# Altium schematic sheet Power.SchDoc
size A4; SheetNumber: 2; SheetTotal: 5
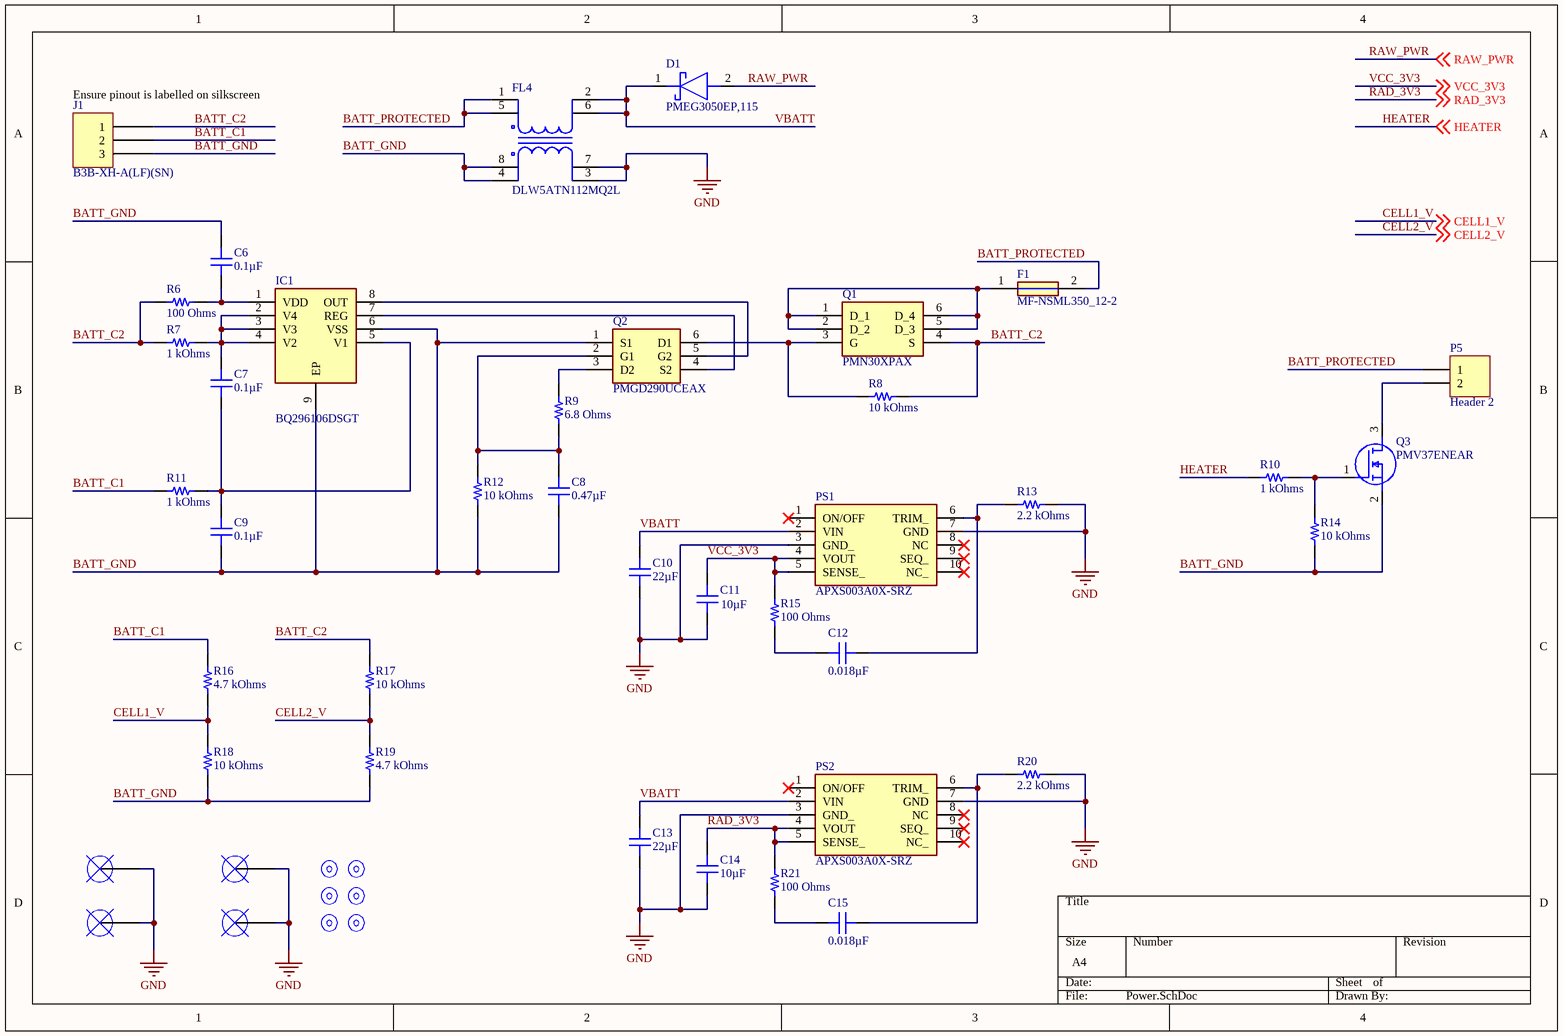
[diagram p0: Power.SchDoc]

## Parts
C6  0.1µF  [CAP 0402_1005]
C7  0.1µF  [CAP 0402_1005]
C8  0.47µF  [CAP 0402_1005]
C9  0.1µF  [CAP 0402_1005]
C10  22µF  [CAP 0805_2012]
C11  10µF  [CAP 0402_1005]
C12  0.018µF  [CAP 0402_1005]
C13  22µF  [CAP 0805_2012]
C14  10µF  [CAP 0402_1005]
C15  0.018µF  [CAP 0402_1005]
D1  PMEG3050EP,115  [PMEG3050EP115]
F1  MF-NSML350_12-2  [FUSC3216X140N]
FL4  DLW5ATN112MQ2L  [DLW5BSN302SQ2L]
FM1  1mm  [FIDUCIAL_MARK_ROUND]  (value not drawn)  (no BOM)
FM2  1mm  [FIDUCIAL_MARK_ROUND]  (value not drawn)  (no BOM)
FM3  1mm  [FIDUCIAL_MARK_ROUND]  (value not drawn)  (no BOM)
FM4  1mm  [FIDUCIAL_MARK_ROUND]  (value not drawn)  (no BOM)
FM5  1mm  [FIDUCIAL_MARK_ROUND]  (value not drawn)  (no BOM)
FM6  1mm  [FIDUCIAL_MARK_ROUND]  (value not drawn)  (no BOM)
IC1  BQ296106DSGT  [SON50P200X200X80-9N]
J1  B3B-XH-A(LF)(SN)  [JST XH B3B-XH-A]
MH1  2.7mm  [Mounting_Hole_Plated_2.7mm-COVERED]  (value not drawn)  (no BOM)
MH2  2.7mm  [Mounting_Hole_Plated_2.7mm-COVERED]  (value not drawn)  (no BOM)
MH3  2.7mm  [Mounting_Hole_Plated_2.7mm-COVERED]  (value not drawn)  (no BOM)
MH4  2.7mm  [Mounting_Hole_Plated_2.7mm-COVERED]  (value not drawn)  (no BOM)
P5  Header 2  [HDR1X2]
PS1  APXS003A0X-SRZ  [APTH003A0XSRZ]
PS2  APXS003A0X-SRZ  [APTH003A0XSRZ]
Q1  PMN30XPAX  [SOT95P275X110-6N]
Q2  PMGD290UCEAX  [SOT65P210X110-6N]
Q3  PMV37ENEAR  [SOT95P230X110-3N]
R6  100 Ohms  [RES 0402_1005]
R7  1 kOhms  [RES 0402_1005]
R8  10 kOhms  [RES 0402_1005]
R9  6.8 Ohms  [RES 0402_1005]
R10  1 kOhms  [RES 0402_1005]
R11  1 kOhms  [RES 0402_1005]
R12  10 kOhms  [RES 0402_1005]
R13  2.2 kOhms  [RES 0402_1005]
R14  10 kOhms  [RES 0402_1005]
R15  100 Ohms  [RES 0402_1005]
R16  4.7 kOhms  [RES 0402_1005]
R17  10 kOhms  [RES 0402_1005]
R18  10 kOhms  [RES 0402_1005]
R19  4.7 kOhms  [RES 0402_1005]
R20  2.2 kOhms  [RES 0402_1005]
R21  100 Ohms  [RES 0402_1005]

## Nets
GND: C10.1 C11.1 C13.1 C14.1 FL4.3 FL4.7 MH1.0 MH2.0 MH3.0 MH4.0 PS1.3(GND_) PS1.7(GND) PS2.3(GND_) PS2.7(GND) R13.1 R20.2
BATT_C1: J1.2 R11.1 R16.2
BATT_C2: J1.1 Q1.4(S) R6.2 R7.1 R8.1 R17.1
BATT_GND: C6.2 C8.1 C9.1 FL4.4 FL4.8 IC1.6(VSS) IC1.9(EP) J1.3 Q2.1(S1) Q3.2(S) R12.2 R14.2 R18.2 R19.1
BATT_PROTECTED: F1.2 FL4.1 FL4.5 P5.1
CELL1_V: R16.1 R18.1 ; off-sheet CELL1_V
CELL2_V: R17.2 R19.2 ; off-sheet CELL2_V
HEATER: R10.1 ; off-sheet HEATER
RAD_3V3: C14.2 PS2.4(VOUT) PS2.5(SENSE_) R21.1 ; off-sheet RAD_3V3
RAW_PWR: D1.2(A) ; off-sheet RAW_PWR
VBATT: C10.2 C13.2 D1.1(K) FL4.2 FL4.6 PS1.2(VIN) PS2.2(VIN)
VCC_3V3: C11.2 PS1.4(VOUT) PS1.5(SENSE_) R15.1 ; off-sheet VCC_3V3
NetC6_1: C6.1 IC1.1(VDD) R6.1
NetC7_1: C7.1 C9.2 IC1.5(V1) R11.2
NetC7_2: C7.2 IC1.2(V4) IC1.3(V3) IC1.4(V2) R7.2
NetC8_2: C8.2 Q2.2(G1) R9.1 R12.1
NetC12_1: C12.1 R15.2
NetC12_2: C12.2 PS1.6(TRIM_) R13.2
NetC15_1: C15.1 R21.2
NetC15_2: C15.2 PS2.6(TRIM_) R20.1
NetF1_1: F1.1 Q1.1(D_1) Q1.2(D_2) Q1.5(D_3) Q1.6(D_4)
NetIC1_7: IC1.7(REG) Q2.4(S2)
NetIC1_8: IC1.8(OUT) Q2.5(G2)
NetP5_2: P5.2 Q3.3(D)
NetQ1_3: Q1.3(G) Q2.6(D1) R8.2
NetQ2_3: Q2.3(D2) R9.2
NetQ3_1: Q3.1(G) R10.2 R14.1

Not connected (* = marked no-connect by the designer): FM1 FD0; FM2 FD0; FM3 FD0; FM4 FD0; FM5 FD0; FM6 FD0; PS1 1(ON/OFF)* 8(NC)* 9(SEQ_)* 10(NC_)*; PS2 1(ON/OFF)* 8(NC)* 9(SEQ_)* 10(NC_)*

## Notes on the sheet
- (near J1) Ensure pinout is labelled on silkscreen

## Library data of the parts
C6 C7 C9 = C0402C104K9PACTU: CAP CER 0.1UF 6.3V X5R 0402; Manufacturer: KEMET; Tolerance: ±10%; Part Number: C0402C104K9PACTU; Value: 0.1µF; Applications: General Purpose; Capacitance: 0.1µF; ComponentLink1Description: Datasheet; ComponentLink1URL: https://api.kemet.com/component-edge/download/datasheet/C0402C104K9PACTU.pdf; ComponentLink2Description: DigiKey Link; ComponentLink2URL: http://digikey.com/product-detail/en/kemet/C0402C104K9PACTU/399-3026-1-ND/447602; Device Package: 0402 (1005 Metric); LastUpdated: 2/9/2020 1:01:34 AM; Lifecycle Status: Active; Minimum Order: 1; Mounting Type: Surface Mount, MLCC; Operating Temperature: -55°C ~ 85°C; Package / Case: 0402 (1005 Metric); Packaging: TapeAndReel; PartId: 12742; Part Status: Active; Price: 0.01; Series: SMD Comm X5R; Size / Dimension: 0.039" L x 0.020" W (1.00mm x 0.50mm); Supplier 1: DigiKey; Supplier Part Number 1: 399-3026-1-ND; Temperature Coefficient: X5R; Thickness (Max): 0.022" (0.55mm); Voltage - Rated: 6.3V
C8 = C1005X5R1E474K050BE: CAP CER 0.47UF 25V X5R 0402; Manufacturer: TDK Corporation; Tolerance: ±10%; Part Number: C1005X5R1E474K050BE; Value: 0.47µF; Applications: Boardflex Sensitive; Capacitance: 0.47µF; ComponentLink1Description: Datasheet; ComponentLink1URL: https://product.tdk.com/info/en/catalog/datasheets/mlcc_commercial_soft_en.pdf?ref_disty=digikey; ComponentLink2Description: DigiKey Link; ComponentLink2URL: http://digikey.com/product-detail/en/tdk-corporation/C1005X5R1E474K050BE/445-175217-1-ND/7907781; Device Package: 0402 (1005 Metric); Features: Soft Termination; LastUpdated: 2/9/2020 1:01:22 AM; Lifecycle Status: Active; Minimum Order: 1; Mounting Type: Surface Mount, MLCC; Operating Temperature: -55°C ~ 85°C; Package / Case: 0402 (1005 Metric); Packaging: TapeAndReel; PartId: 13175; Part Status: Active; Price: 0.02; Series: C; Size / Dimension: 0.039" L x 0.020" W (1.00mm x 0.50mm); Supplier 1: DigiKey; Supplier Part Number 1: 445-175217-1-ND; Temperature Coefficient: X5R; Thickness (Max): 0.024" (0.60mm); Voltage - Rated: 25V
C10 C13 = C2012X6S1C226M125AC: CAP CER 22UF 16V X6S 0805; Manufacturer: TDK Corporation; Tolerance: ±20%; Part Number: C2012X6S1C226M125AC; Value: 22µF; Applications: General Purpose; Capacitance: 22µF; ComponentLink1Description: Datasheet; ComponentLink1URL: https://product.tdk.com/info/en/catalog/datasheets/mlcc_commercial_general_en.pdf?ref_disty=digikey; ComponentLink2Description: DigiKey Link; ComponentLink2URL: http://digikey.com/product-detail/en/tdk-corporation/C2012X6S1C226M125AC/445-14486-1-ND/3956152; Device Package: 0805 (2012 Metric); Features: Low ESL; LastUpdated: 2/9/2020 1:04:25 AM; Lifecycle Status: Active; Minimum Order: 1; Mounting Type: Surface Mount, MLCC; Operating Temperature: -55°C ~ 105°C; Package / Case: 0805 (2012 Metric); Packaging: TapeAndReel; PartId: 11672; Part Status: Active; Price: 0.19; Series: C; Size / Dimension: 0.079" L x 0.049" W (2.00mm x 1.25mm); Supplier 1: DigiKey; Supplier Part Number 1: 445-14486-1-ND; Temperature Coefficient: X6S; Thickness (Max): 0.057" (1.45mm); Voltage - Rated: 16V
C11 C14 = C0402C106M9PAC7867: CAP CER 10UF 6.3V X5R 0402; Manufacturer: KEMET; Tolerance: ±20%; Part Number: C0402C106M9PAC7867; Value: 10µF; Applications: General Purpose; Capacitance: 10µF; ComponentLink1Description: Datasheet; ComponentLink1URL: https://api.kemet.com/component-edge/download/datasheet/C0402C106M9PAC7867.pdf; ComponentLink2Description: DigiKey Link; ComponentLink2URL: http://digikey.com/product-detail/en/kemet/C0402C106M9PAC7867/399-13069-1-ND/5767556; Device Package: 0402 (1005 Metric); LastUpdated: 2/9/2020 1:02:21 AM; Lifecycle Status: Active; Minimum Order: 1; Mounting Type: Surface Mount, MLCC; Operating Temperature: -55°C ~ 85°C; Package / Case: 0402 (1005 Metric); Packaging: TapeAndReel; PartId: 3087; Part Status: Active; Price: 0.13; Series: SMD Comm X5R; Size / Dimension: 0.039" L x 0.020" W (1.00mm x 0.50mm); Supplier 1: DigiKey; Supplier Part Number 1: 399-13069-1-ND; Temperature Coefficient: X5R; Thickness (Max): 0.028" (0.70mm); Voltage - Rated: 6.3V
C12 C15 = CC0402KRX7R8BB183: CAP CER 0.018UF 25V X7R 0402; Manufacturer: Yageo; Tolerance: ±10%; Part Number: CC0402KRX7R8BB183; Value: 0.018µF; Applications: General Purpose; Capacitance: 0.018µF; ComponentLink1Description: Datasheet; ComponentLink1URL: https://www.yageo.com/upload/media/product/productsearch/datasheet/mlcc/UPY-GPHC_X7R_6.3V-to-50V_18.pdf; ComponentLink2Description: DigiKey Link; ComponentLink2URL: http://digikey.com/product-detail/en/yageo/CC0402KRX7R8BB183/311-3345-1-ND/6818315; Device Package: 0402 (1005 Metric); LastUpdated: 2/9/2020 1:02:03 AM; Lifecycle Status: Active; Minimum Order: 1; Mounting Type: Surface Mount, MLCC; Operating Temperature: -55°C ~ 125°C; Package / Case: 0402 (1005 Metric); Packaging: TapeAndReel; PartId: 11317; Part Status: Active; Price: 0.01; Series: CC; Size / Dimension: 0.039" L x 0.020" W (1.00mm x 0.50mm); Supplier 1: DigiKey; Supplier Part Number 1: 311-3345-1-ND; Temperature Coefficient: X7R; Thickness (Max): 0.022" (0.55mm); Voltage - Rated: 25V
D1 = PMEG3050EP,115: Schottky Diode; Manufacturer_Name: Nexperia; Datasheet Link: https://datasheet.datasheetarchive.com/originals/distributors/Datasheets_SAMA/fa882cf4aa6eed6383790f96e9182165.pdf; Height: 1mm; Manufacturer_Part_Number: PMEG3050EP,115
F1 = MF-NSML350_12-2: Fuse; Manufacturer_Name: Bourns; Manufacturer_Part_Number: MF-NSML350/12-2; Datasheet Link: https://componentsearchengine.com/Datasheets/1/MF-NSML350_12-2.pdf; Height: 1.4mm
FL4 = DLW5ATN112MQ2L: Filter; Manufacturer_Name: Murata Electronics; Datasheet Link: https://componentsearchengine.com//DLW5ATN112MQ2L.pdf; Height: 2.35mm; Mouser2 Part Number: 81-DLW5ATN112MQ2L; Mouser2 Price/Stock: https://www.mouser.com/Search/Refine.aspx?Keyword=81-DLW5ATN112MQ2L; Manufacturer_Part_Number: DLW5ATN112MQ2L
FM1-FM6 = Fiducial_Mark: Fiducial mark, width 1mm, clearance 3mm; Width: 1 mm; Clearance: 3 mm
IC1 = BQ296106DSGT: Integrated Circuit; Manufacturer_Name: Texas Instruments; Datasheet Link: https://www.ti.com/lit/ds/symlink/bq2961.pdf?ts=1629467003310&ref_url=https%253A%252F%252Fwww.ti.com%252Fstore%252Fti%252Fen%252Fp%252Fproduct%252F%253Fp%253DBQ296106DSGT; Height: 0.8mm; Manufacturer_Part_Number: BQ296106DSGT
J1 = B3B-XH-A(LF)(SN): CONN HEADER VERT 3POS 2.5MM; Manufacturer: JST Sales America Inc.; Contact Length - Post: 0.134" (3.40mm); Current Rating (Amps): 3A; Material Flammability Rating: UL94 V-0; Number of Positions: 3; Number of Positions Loaded: All; Pitch - Mating: 0.098" (2.50mm); Shrouding: Shrouded - 4 Wall; Style: Board to Cable/Wire; Voltage Rating: 250V; Part Number: B3B-XH-A(LF)(SN); ComponentLink1Description: Datasheet; ComponentLink1URL: http://www.jst-mfg.com/product/pdf/eng/eXH.pdf; ComponentLink2Description: DigiKey Link; ComponentLink2URL: http://digikey.com/product-detail/en/jst-sales-america-inc/B3B-XH-A-LF-SN/455-2248-ND/1651046; Connector Type: Header; Contact Finish - Mating: Tin; Contact Finish - Post: Tin; Contact Material: Brass; Contact Shape: Square; Contact Type: Male Pin; Fastening Type: Detent Lock; Insulation Color: Natural; Insulation Height: 0.276" (7.00mm); Insulation Material: Polyamide (PA66), Nylon 6/6; LastUpdated: 12/1/2020 11:46:22 PM; Lifecycle Status: Active; Minimum Order: 1; Mounting Type: Through Hole; Number of Rows: 1; Operating Temperature: -25°C ~ 85°C; Packaging: Bulk; PartId: 68; Part Status: Active; Price: 0.19; Series: XH; Supplier 1: DigiKey; Supplier Part Number 1: 455-2248-ND; Termination: Press-Fit, Solder
MH1-MH4 = Mounting_Hole_2.7mm: Mounting hole, hole size 2.7mm; Hole radius: 2.7 mm; Diameter (plated): *; Keep out (radius): *; Plated: *
P5 = Header 2: Header, 2-Pin; LatestRevisionDate: 17-Jul-2002; LatestRevisionNote: Re-released for DXP Platform.; Publisher: Altium Limited
PS1 PS2 = APXS003A0X-SRZ: Power Supply; Manufacturer_Name: ABB; Datasheet Link: https://www.mouser.sg/datasheet/2/167/APTS003A0X-1920083.pdf; Height: 6.25mm; Manufacturer_Part_Number: APXS003A0X-SRZ
Q1 = PMN30XPAX: MOSFET (P-Channel); Manufacturer_Name: Nexperia; Datasheet Link: https://www.mouser.in/datasheet/2/916/PMN30XPA-1839888.pdf; Height: 1.1mm; Manufacturer_Part_Number: PMN30XPAX
Q2 = PMGD290UCEAX: Transistor; Manufacturer_Name: Nexperia; Datasheet Link: https://ms.componentsearchengine.com/Datasheets/2/PMGD290UCEAX.pdf; Height: 1.1mm; Manufacturer_Part_Number: PMGD290UCEAX
Q3 = PMV37ENEAR: MOSFET (N-Channel); Manufacturer_Name: Nexperia; Datasheet Link: https://componentsearchengine.com/Datasheets/2/PMV37ENEAR.pdf; Height: 1.1mm; Manufacturer_Part_Number: PMV37ENEAR
R6 R15 R21 = CRG0402F100R: RES SMD 100 OHM 1% 1/16W 0402; Manufacturer: TE Connectivity Passive Product; Power (Watts): 0.063W, 1/16W; Temperature Coefficient: ±100ppm/°C; Part Number: CRG0402F100R; Value: 100 Ohms; ComponentLink1Description: Datasheet; ComponentLink1URL: https://www.te.com/commerce/DocumentDelivery/DDEController?Action=srchrtrv&DocNm=1773204&DocType=DS&DocLang=English; ComponentLink2Description: DigiKey Link; ComponentLink2URL: http://digikey.com/product-detail/en/te-connectivity-passive-product/CRG0402F100R/A121527CT-ND/5246516; Composition: Thick Film; Device Package: 0402 (1005 Metric); Height - Seated (Max): 0.016" (0.40mm); LastUpdated: 2/9/2020 1:07:28 AM; Lifecycle Status: Active; Minimum Order: 1; Number of Terminations: 2; Operating Temperature: -55°C ~ 155°C; Package / Case: 0402 (1005 Metric); Packaging: CutTape; PartId: 20718; Part Status: Active; Price: 0.10; Resistance: 100 Ohms; Series: CRG, Neohm; Size / Dimension: 0.039" L x 0.020" W (1.00mm x 0.50mm); Supplier 1: DigiKey; Supplier Part Number 1: A121527CT-ND; Supplier Device Package: 0402; Tolerance: ±1%
R7 R10 R11 = CRCW04021K00FKEDC: RES SMD 1K OHM 1% 1/16W 0402; Manufacturer: Vishay Dale; Power (Watts): 0.063W, 1/16W; Temperature Coefficient: ±100ppm/°C; Part Number: CRCW04021K00FKEDC; Value: 1 kOhms; ComponentLink1Description: Datasheet; ComponentLink1URL: http://www.vishay.com/docs/28773/crcwce3.pdf; ComponentLink2Description: DigiKey Link; ComponentLink2URL: http://digikey.com/product-detail/en/vishay-dale/CRCW04021K00FKEDC/541-3961-1-ND/7928644; Composition: Thick Film; Device Package: 0402 (1005 Metric); Height - Seated (Max): 0.014" (0.35mm); LastUpdated: 2/9/2020 1:07:49 AM; Lifecycle Status: Active; Minimum Order: 1; Number of Terminations: 2; Operating Temperature: -55°C ~ 155°C; Package / Case: 0402 (1005 Metric); Packaging: CutTape; PartId: 12669; Part Status: Active; Price: 0.10; Resistance: 1 kOhms; Series: CRCW-C; Size / Dimension: 0.039" L x 0.020" W (1.00mm x 0.50mm); Supplier 1: DigiKey; Supplier Part Number 1: 541-3961-1-ND; Supplier Device Package: 0402; Tolerance: ±1%
R8 R12 R14 R17 R18 = CPF0402B10KE1: RES SMD 10K OHM 0.1% 1/16W 0402; Manufacturer: TE Connectivity Passive Product; Power (Watts): 0.063W, 1/16W; Temperature Coefficient: ±25ppm/°C; Part Number: CPF0402B10KE1; Value: 10 kOhms; ComponentLink1Description: Datasheet; ComponentLink1URL: https://www.te.com/commerce/DocumentDelivery/DDEController?Action=srchrtrv&DocNm=1773200&DocType=DS&DocLang=English; ComponentLink2Description: DigiKey Link; ComponentLink2URL: http://digikey.com/product-detail/en/te-connectivity-passive-product/CPF0402B10KE1/A102579CT-ND/2729112; Composition: Thin Film; Device Package: 0402 (1005 Metric); Height - Seated (Max): 0.014" (0.35mm); LastUpdated: 2/9/2020 1:07:41 AM; Lifecycle Status: Active; Minimum Order: 1; Number of Terminations: 2; Operating Temperature: -55°C ~ 155°C; Package / Case: 0402 (1005 Metric); Packaging: TapeAndReel; PartId: 15889; Part Status: Active; Price: 0.13; Resistance: 10 kOhms; Series: CPF, Neohm; Size / Dimension: 0.039" L x 0.020" W (1.00mm x 0.50mm); Supplier 1: DigiKey; Supplier Part Number 1: A102579CT-ND; Supplier Device Package: 0402; Tolerance: ±0.1%
R9 = ERJ-2GEJ6R8X: RES SMD 6.8 OHM 5% 1/10W 0402; Manufacturer: Panasonic Electronic Components; Power (Watts): 0.1W, 1/10W; Temperature Coefficient: -100/ +600ppm/°C; Part Number: ERJ-2GEJ6R8X; Value: 6.8 Ohms; ComponentLink1Description: Datasheet; ComponentLink1URL: https://b2b-api.panasonic.eu/file_stream/pids/fileversion/1242; ComponentLink2Description: DigiKey Link; ComponentLink2URL: http://digikey.com/product-detail/en/panasonic-electronic-components/ERJ-2GEJ6R8X/P6.8JCT-ND/282384; Composition: Thick Film; Device Package: 0402 (1005 Metric); Features: Automotive AEC-Q200; Height - Seated (Max): 0.016" (0.40mm); LastUpdated: 2/9/2020 1:08:02 AM; Lifecycle Status: Active; Minimum Order: 1; Number of Terminations: 2; Operating Temperature: -55°C ~ 155°C; Package / Case: 0402 (1005 Metric); Packaging: CutTape; PartId: 6342; Part Status: Active; Price: 0.10; Ratings: AEC-Q200; Resistance: 6.8 Ohms; Series: ERJ; Size / Dimension: 0.039" L x 0.020" W (1.00mm x 0.50mm); Supplier 1: DigiKey; Supplier Part Number 1: P6.8JCT-ND; Supplier Device Package: 0402; Tolerance: ±5%
R13 R20 = CPF0402B2K2E1: RES SMD 2.2K OHM 0.1% 1/16W 0402; Manufacturer: TE Connectivity Passive Product; Power (Watts): 0.063W, 1/16W; Temperature Coefficient: ±25ppm/°C; Part Number: CPF0402B2K2E1; Value: 2.2 kOhms; ComponentLink1Description: Datasheet; ComponentLink1URL: https://www.te.com/commerce/DocumentDelivery/DDEController?Action=srchrtrv&DocNm=1773200&DocType=DS&DocLang=English; ComponentLink2Description: DigiKey Link; ComponentLink2URL: http://digikey.com/product-detail/en/te-connectivity-passive-product/CPF0402B2K2E1/A102766CT-ND/2729299; Composition: Thin Film; Device Package: 0402 (1005 Metric); Height - Seated (Max): 0.014" (0.35mm); LastUpdated: 2/9/2020 1:08:09 AM; Lifecycle Status: Active; Minimum Order: 1; Number of Terminations: 2; Operating Temperature: -55°C ~ 155°C; Package / Case: 0402 (1005 Metric); Packaging: TapeAndReel; PartId: 3342; Part Status: Active; Price: 0.14; Resistance: 2.2 kOhms; Series: CPF, Neohm; Size / Dimension: 0.039" L x 0.020" W (1.00mm x 0.50mm); Supplier 1: DigiKey; Supplier Part Number 1: A102766CT-ND; Supplier Device Package: 0402; Tolerance: ±0.1%
R16 R19 = CRCW04024K70JNEDC: RES SMD 4.7K OHM 5% 1/16W 0402; Manufacturer: Vishay Dale; Power (Watts): 0.063W, 1/16W; Temperature Coefficient: ±200ppm/°C; Part Number: CRCW04024K70JNEDC; Value: 4.7 kOhms; ComponentLink1Description: Datasheet; ComponentLink1URL: http://www.vishay.com/docs/28773/crcwce3.pdf; ComponentLink2Description: DigiKey Link; ComponentLink2URL: http://digikey.com/product-detail/en/vishay-dale/CRCW04024K70JNEDC/541-3974-1-ND/7928657; Composition: Thick Film; Device Package: 0402 (1005 Metric); Height - Seated (Max): 0.014" (0.35mm); LastUpdated: 2/9/2020 1:07:41 AM; Lifecycle Status: Active; Minimum Order: 1; Number of Terminations: 2; Operating Temperature: -55°C ~ 155°C; Package / Case: 0402 (1005 Metric); Packaging: CutTape; PartId: 15960; Part Status: Active; Price: 0.10; Resistance: 4.7 kOhms; Series: CRCW-C; Size / Dimension: 0.039" L x 0.020" W (1.00mm x 0.50mm); Supplier 1: DigiKey; Supplier Part Number 1: 541-3974-1-ND; Supplier Device Package: 0402; Tolerance: ±5%